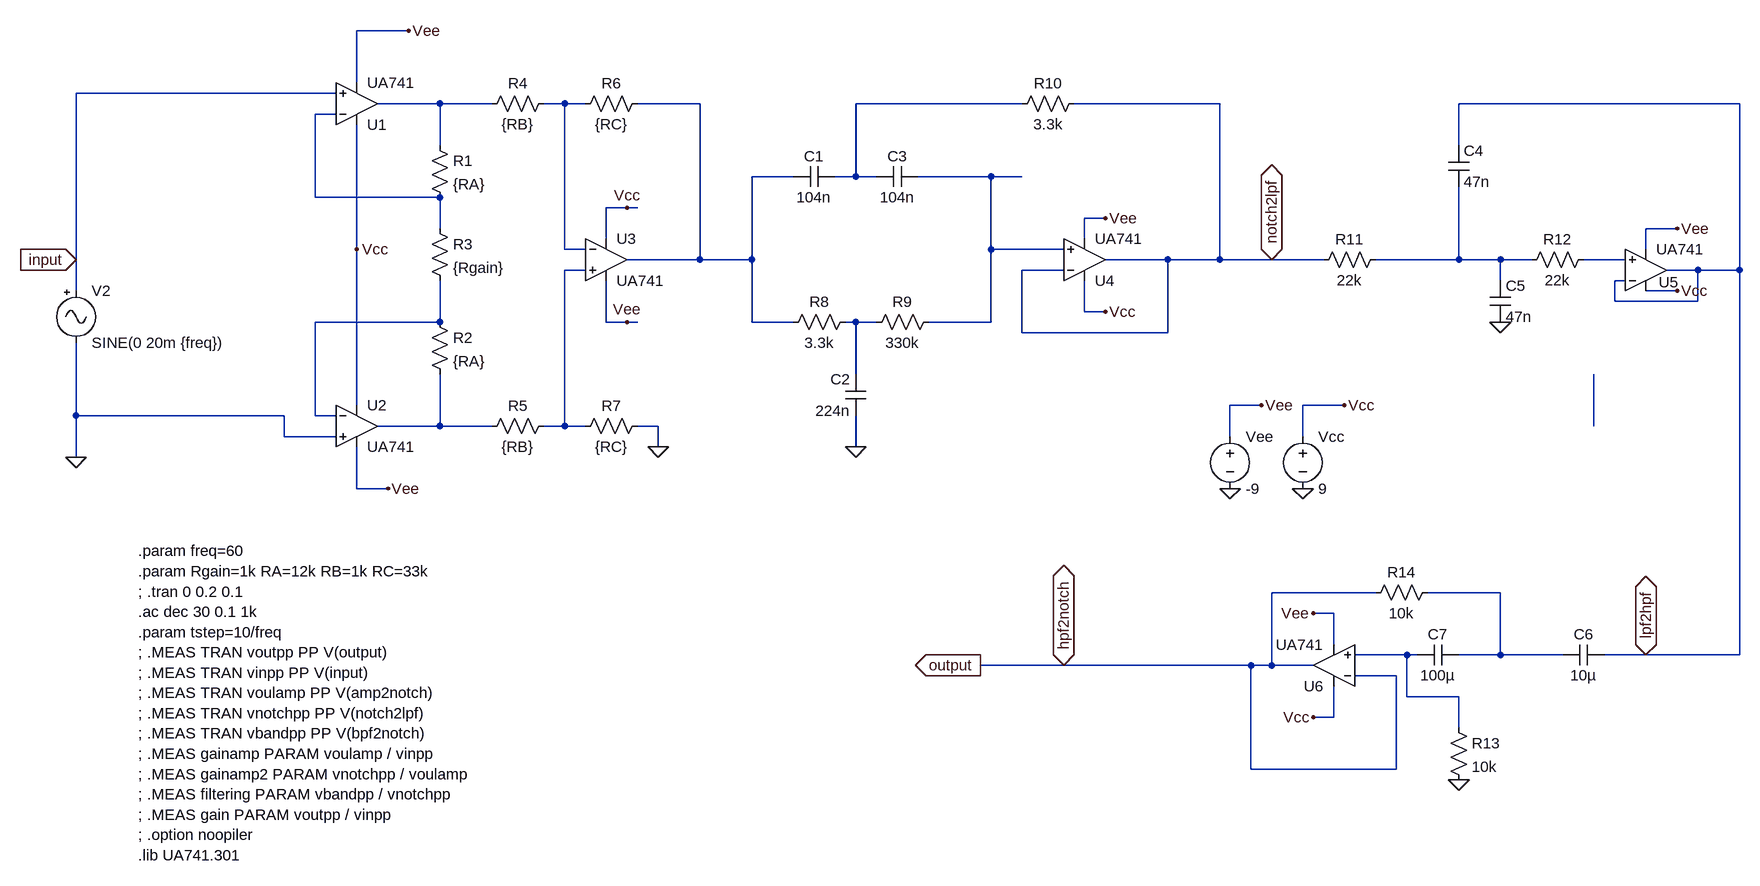
[diagram p0: schematic ECG_Project.asc]
ECG_Project.asc, the LTspice schematic file:
Version 4
SHEET 1 2680 1632
WIRE 624 -112 544 -112
WIRE 544 -32 544 -112
WIRE 512 -16 112 -16
WIRE 672 0 576 0
WIRE 752 0 672 0
WIRE 864 0 832 0
WIRE 896 0 864 0
WIRE 1072 0 976 0
WIRE 1568 0 1312 0
WIRE 1872 0 1648 0
WIRE 2672 0 2240 0
WIRE 512 16 480 16
WIRE 672 64 672 0
WIRE 2240 64 2240 0
WIRE 1216 112 1152 112
WIRE 1312 112 1312 0
WIRE 1312 112 1280 112
WIRE 1344 112 1312 112
WIRE 1520 112 1408 112
WIRE 1568 112 1520 112
WIRE 480 144 480 16
WIRE 672 144 480 144
WIRE 960 160 928 160
WIRE 976 160 960 160
WIRE 1696 176 1664 176
WIRE 672 192 672 144
WIRE 2576 192 2528 192
WIRE 928 208 928 160
WIRE 1664 208 1664 176
WIRE 544 224 544 32
WIRE 864 224 864 0
WIRE 896 224 864 224
WIRE 1520 224 1520 112
WIRE 1632 224 1520 224
WIRE 2528 224 2528 192
WIRE 112 240 112 -16
WIRE 1072 240 1072 0
WIRE 1072 240 960 240
WIRE 1152 240 1152 112
WIRE 1152 240 1072 240
WIRE 1792 240 1696 240
WIRE 1872 240 1872 0
WIRE 1872 240 1792 240
WIRE 1952 240 1872 240
WIRE 2032 240 1952 240
WIRE 2240 240 2240 128
WIRE 2240 240 2112 240
WIRE 2304 240 2240 240
WIRE 2352 240 2304 240
WIRE 2496 240 2432 240
WIRE 896 256 864 256
WIRE 1632 256 1568 256
WIRE 2608 256 2560 256
WIRE 2672 256 2672 0
WIRE 2672 256 2608 256
WIRE 2304 272 2304 240
WIRE 2496 272 2480 272
WIRE 112 288 112 240
WIRE 2576 288 2528 288
WIRE 2480 304 2480 272
WIRE 2608 304 2608 256
WIRE 2608 304 2480 304
WIRE 1664 320 1664 272
WIRE 1696 320 1664 320
WIRE 672 336 672 272
WIRE 672 336 480 336
WIRE 928 336 928 272
WIRE 960 336 928 336
WIRE 976 336 960 336
WIRE 1152 336 1152 240
WIRE 1216 336 1152 336
WIRE 1312 336 1296 336
WIRE 1344 336 1312 336
WIRE 1520 336 1520 224
WIRE 1520 336 1424 336
WIRE 1568 352 1568 256
WIRE 1792 352 1792 240
WIRE 1792 352 1568 352
WIRE 1312 416 1312 336
WIRE 544 464 544 224
WIRE 1936 464 1888 464
WIRE 2064 464 2000 464
WIRE 112 480 112 368
WIRE 432 480 112 480
WIRE 480 480 480 336
WIRE 512 480 480 480
WIRE 672 496 672 416
WIRE 672 496 576 496
WIRE 752 496 672 496
WIRE 864 496 864 256
WIRE 864 496 832 496
WIRE 896 496 864 496
WIRE 1008 496 976 496
WIRE 2448 496 2448 416
WIRE 432 512 432 480
WIRE 512 512 432 512
WIRE 1888 512 1888 464
WIRE 2000 512 2000 464
WIRE 1008 528 1008 496
WIRE 1312 528 1312 480
WIRE 112 544 112 480
WIRE 544 592 544 528
WIRE 592 592 544 592
WIRE 2112 752 1952 752
WIRE 2304 752 2192 752
WIRE 2048 784 2016 784
WIRE 2048 832 2048 784
WIRE 2160 848 2080 848
WIRE 2176 848 2160 848
WIRE 2304 848 2304 752
WIRE 2304 848 2240 848
WIRE 2400 848 2304 848
WIRE 2528 848 2464 848
WIRE 2672 848 2672 256
WIRE 2672 848 2528 848
WIRE 1632 864 1504 864
WIRE 1920 864 1632 864
WIRE 1952 864 1952 752
WIRE 1952 864 1920 864
WIRE 2016 864 1952 864
WIRE 2144 880 2080 880
WIRE 2160 912 2160 848
WIRE 2240 912 2160 912
WIRE 2048 944 2048 896
WIRE 2048 944 2016 944
WIRE 2240 960 2240 912
WIRE 1920 1024 1920 864
WIRE 2144 1024 2144 880
WIRE 2144 1024 1920 1024
FLAG 112 544 0
FLAG 112 240 input
IOPIN 112 240 In
FLAG 960 336 Vee
FLAG 960 160 Vcc
FLAG 1312 528 0
FLAG 1952 240 notch2lpf
IOPIN 1952 240 BiDir
FLAG 2304 336 0
FLAG 1008 528 0
FLAG 1504 864 output
IOPIN 1504 864 Out
FLAG 1632 864 hpf2notch
IOPIN 1632 864 BiDir
FLAG 2240 1040 0
FLAG 2528 848 lpf2hpf
IOPIN 2528 848 BiDir
FLAG 2016 784 Vee
FLAG 2016 944 Vcc
FLAG 1696 320 Vcc
FLAG 1696 176 Vee
FLAG 2576 288 Vcc
FLAG 2576 192 Vee
FLAG 1888 592 0
FLAG 2000 592 0
FLAG 2064 464 Vcc
FLAG 1936 464 Vee
FLAG 592 592 Vee
FLAG 624 -112 Vee
FLAG 544 224 Vcc
SYMBOL signal 112 272 R0
SYMATTR InstName V2
SYMATTR Value SINE(0 20m {freq})
SYMATTR Value2 AC 1
SYMBOL opamp2 544 64 M180
SYMATTR InstName U1
SYMATTR Value UA741
SYMBOL opamp2 544 432 R0
SYMATTR InstName U2
SYMATTR Value UA741
SYMBOL res 656 48 R0
SYMATTR InstName R1
SYMATTR Value {RA}
SYMBOL res 656 320 R0
SYMATTR InstName R2
SYMATTR Value {RA}
SYMBOL res 656 176 R0
SYMATTR InstName R3
SYMATTR Value {Rgain}
SYMBOL res 848 -16 R90
WINDOW 0 0 56 VBottom 2
WINDOW 3 32 56 VTop 2
SYMATTR InstName R4
SYMATTR Value {RB}
SYMBOL res 848 480 R90
WINDOW 0 0 56 VBottom 2
WINDOW 3 32 56 VTop 2
SYMATTR InstName R5
SYMATTR Value {RB}
SYMBOL res 992 -16 R90
WINDOW 0 0 56 VBottom 2
WINDOW 3 32 56 VTop 2
SYMATTR InstName R6
SYMATTR Value {RC}
SYMBOL res 992 480 R90
WINDOW 0 0 56 VBottom 2
WINDOW 3 32 56 VTop 2
SYMATTR InstName R7
SYMATTR Value {RC}
SYMBOL opamp2 928 176 R0
SYMATTR InstName U3
SYMATTR Value UA741
SYMBOL cap 1280 96 R90
WINDOW 0 0 32 VBottom 2
WINDOW 3 32 32 VTop 2
SYMATTR InstName C1
SYMATTR Value 104n
SYMBOL cap 1408 96 R90
WINDOW 0 0 32 VBottom 2
WINDOW 3 32 32 VTop 2
SYMATTR InstName C3
SYMATTR Value 104n
SYMBOL res 1312 320 R90
WINDOW 0 0 56 VBottom 2
WINDOW 3 32 56 VTop 2
SYMATTR InstName R8
SYMATTR Value 3.3k
SYMBOL res 1440 320 R90
WINDOW 0 0 56 VBottom 2
WINDOW 3 32 56 VTop 2
SYMATTR InstName R9
SYMATTR Value 330k
SYMBOL cap 1328 416 M0
SYMATTR InstName C2
SYMATTR Value 224n
SYMBOL opamp2 1664 304 M180
SYMATTR InstName U4
SYMATTR Value UA741
SYMBOL res 1664 -16 R90
WINDOW 0 0 56 VBottom 2
WINDOW 3 32 56 VTop 2
SYMATTR InstName R10
SYMATTR Value 3.3k
SYMBOL res 2128 224 R90
WINDOW 0 0 56 VBottom 2
WINDOW 3 32 56 VTop 2
SYMATTR InstName R11
SYMATTR Value 22k
SYMBOL res 2448 224 R90
WINDOW 0 0 56 VBottom 2
WINDOW 3 32 56 VTop 2
SYMATTR InstName R12
SYMATTR Value 22k
SYMBOL cap 2224 64 R0
SYMATTR InstName C4
SYMATTR Value 47n
SYMBOL opamp2 2528 320 M180
WINDOW 0 20 45 Left 2
SYMATTR InstName U5
SYMATTR Value UA741
SYMBOL cap 2288 272 R0
SYMATTR InstName C5
SYMATTR Value 47n
SYMBOL cap 2464 832 R90
WINDOW 0 0 32 VBottom 2
WINDOW 3 32 32 VTop 2
SYMATTR InstName C6
SYMATTR Value 10µ
SYMBOL cap 2240 832 R90
WINDOW 0 0 32 VBottom 2
WINDOW 3 32 32 VTop 2
SYMATTR InstName C7
SYMATTR Value 100µ
SYMBOL res 2224 944 R0
SYMATTR InstName R13
SYMATTR Value 10k
SYMBOL res 2208 736 R90
WINDOW 0 0 56 VBottom 2
WINDOW 3 32 56 VTop 2
SYMATTR InstName R14
SYMATTR Value 10k
SYMBOL voltage 1888 496 R0
SYMATTR InstName Vee
SYMATTR Value -9
SYMBOL voltage 2000 496 R0
SYMATTR InstName Vcc
SYMATTR Value 9
SYMBOL opamp2 2048 928 R180
SYMATTR InstName U6
SYMATTR Value UA741
TEXT 208 688 Left 2 !.param freq=60\n.param Rgain=1k RA=12k RB=1k RC=33k\n; .tran 0 0.2 0.1\n.ac dec 30 0.1 1k\n.param tstep=10/freq\n; .MEAS TRAN voutpp PP V(output)\n; .MEAS TRAN vinpp PP V(input)\n; .MEAS TRAN voulamp PP V(amp2notch)\n; .MEAS TRAN vnotchpp PP V(notch2lpf)\n; .MEAS TRAN vbandpp PP V(bpf2notch)\n; .MEAS gainamp PARAM voulamp / vinpp\n; .MEAS gainamp2 PARAM vnotchpp / voulamp\n; .MEAS filtering PARAM vbandpp / vnotchpp\n; .MEAS gain PARAM voutpp / vinpp\n; .option noopiler\n.lib UA741.301

The netlist it stands for:
* ECG_Project.asc
V2 input 0 SINE(0 20m {freq}) AC 1
XU1 input N005 Vcc Vee N001 UA741  ; pins In+ In- V+ V- OUT
XU2 0 N010 Vcc Vee N012 UA741  ; pins In+ In- V+ V- OUT
R1 N001 N005 {RA}
R2 N010 N012 {RA}
R3 N005 N010 {Rgain}
R4 N002 N001 {RB}
R5 N009 N012 {RB}
R6 N003 N002 {RC}
R7 0 N009 {RC}
XU3 N009 N002 Vcc Vee N003 UA741  ; pins In+ In- V+ V- OUT
C1 N004 N003 104n
C3 N006 N004 104n
R8 N011 N003 3.3k
R9 N006 N011 330k
C2 N011 0 224n
XU4 N006 notch2lpf Vcc Vee notch2lpf UA741  ; pins In+ In- V+ V- OUT
R10 notch2lpf N004 3.3k
R11 N007 notch2lpf 22k
R12 N008 N007 22k
C4 lpf2hpf N007 47n
XU5 N008 lpf2hpf Vcc Vee lpf2hpf UA741  ; pins In+ In- V+ V- OUT
C5 N007 0 47n
C6 lpf2hpf N014 10µ
C7 N014 N015 100µ
R13 N015 0 10k
R14 N014 hpf2notch 10k
Vee Vee 0 -9
Vcc Vcc 0 9
XU6 N015 hpf2notch Vcc Vee hpf2notch UA741  ; pins In+ In- V+ V- OUT
.param freq=60
.param Rgain=1k RA=12k RB=1k RC=33k
; .tran 0 0.2 0.1
.ac dec 30 0.1 1k
.param tstep=10/freq
; .MEAS TRAN voutpp PP V(output)
; .MEAS TRAN vinpp PP V(input)
; .MEAS TRAN voulamp PP V(amp2notch)
; .MEAS TRAN vnotchpp PP V(notch2lpf)
; .MEAS TRAN vbandpp PP V(bpf2notch)
; .MEAS gainamp PARAM voulamp / vinpp
; .MEAS gainamp2 PARAM vnotchpp / voulamp
; .MEAS filtering PARAM vbandpp / vnotchpp
; .MEAS gain PARAM voutpp / vinpp
; .option noopiler
.lib UA741.301
.backanno
.end